# Altium schematic sheet Temp.SchDoc
size A4; SheetNumber: 13; SheetTotal: 13
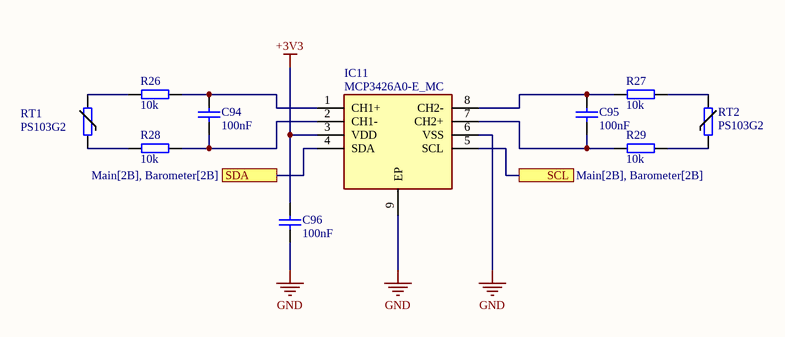
[diagram p0: Temp.SchDoc]

## Parts
C94  value 100nF  [CAP0402]  (hidden comment: Cap0402)
C95  value 100nF  [CAP0402]  (hidden comment: Cap0402)
C96  value 100nF  [CAP0402]  (hidden comment: Cap0402)
IC11  MCP3426A0-E_MC  [SON50P300X200X100-9N-D]
R26  value 10k  [RES0402]  (hidden comment: Res0402)
R27  value 10k  [RES0402]  (hidden comment: Res0402)
R28  value 10k  [RES0402]  (hidden comment: Res0402)
R29  value 10k  [RES0402]  (hidden comment: Res0402)
RT1  PS103G2  [PS103G2]
RT2  PS103G2  [PS103G2]

## Ports
SCL (see Main[2B], Barometer[2B]), SDA (see Main[2B], Barometer[2B])

## Nets
+3V3: C96.2 IC11.3(VDD)
GND: C96.1 IC11.6(VSS) IC11.9(EP)
SCL: IC11.5(SCL) ; port SCL
SDA: IC11.4(SDA) ; port SDA
NetC94_1: C94.1 IC11.2(CH1-) R28.1
NetC94_2: C94.2 IC11.1(CH1+) R26.1
NetC95_1: C95.1 IC11.7(CH2+) R29.1
NetC95_2: C95.2 IC11.8(CH2-) R27.1
NetR26_2: R26.2 RT1.2
NetR27_2: R27.2 RT2.2
NetR28_2: R28.2 RT1.1
NetR29_2: R29.2 RT2.1

## Library data of the parts
C94-C96 = Cap0402: Manufacturer_Part_Number: GRM155R71H104ME14D; Voltage: 50V
IC11 = MCP3426A0-E_MC: Integrated Circuit; Manufacturer_Name: Microchip; Manufacturer_Part_Number: MCP3426A0-E/MC; Datasheet Link: http://www.microchip.com/mymicrochip/filehandler.aspx?ddocname=en546216; Height: 1mm; Mouser Part Number: 579-MCP3426A0E/MC; Mouser Price/Stock: https://www.mouser.co.uk/ProductDetail/Microchip-Technology/MCP3426A0-E-MC?qs=icxrp76fIjCY1JH54pALjQ%3D%3D; Arrow Part Number: MCP3426A0-E/MC; Arrow Price/Stock: https://www.arrow.com/en/products/mcp3426a0-emc/microchip-technology?region=nac
R26-R29 = Res0402: Manufacturer_Part_Number: ERA-2AED103X
RT1 RT2 = PS103G2: Thermistor; Manufacturer_Name: LITTELFUSE; Datasheet Link: https://componentsearchengine.com/Datasheets/1/PS103G2.pdf; Height: 2.413mm; Manufacturer_Part_Number: PS103G2; Mouser Part Number: 803-PS103G2; Mouser Price/Stock: https://www.mouser.co.uk/ProductDetail/Littelfuse/PS103G2?qs=gGwQ3tp6HcSgjlOXbgIaWw%3D%3D; Arrow Part Number: PS103G2; Arrow Price/Stock: https://www.arrow.com/en/products/ps103g2/littelfuse